# Altium schematic sheet [0X] - AUDIO.SchDoc
size 513 x 386 mm
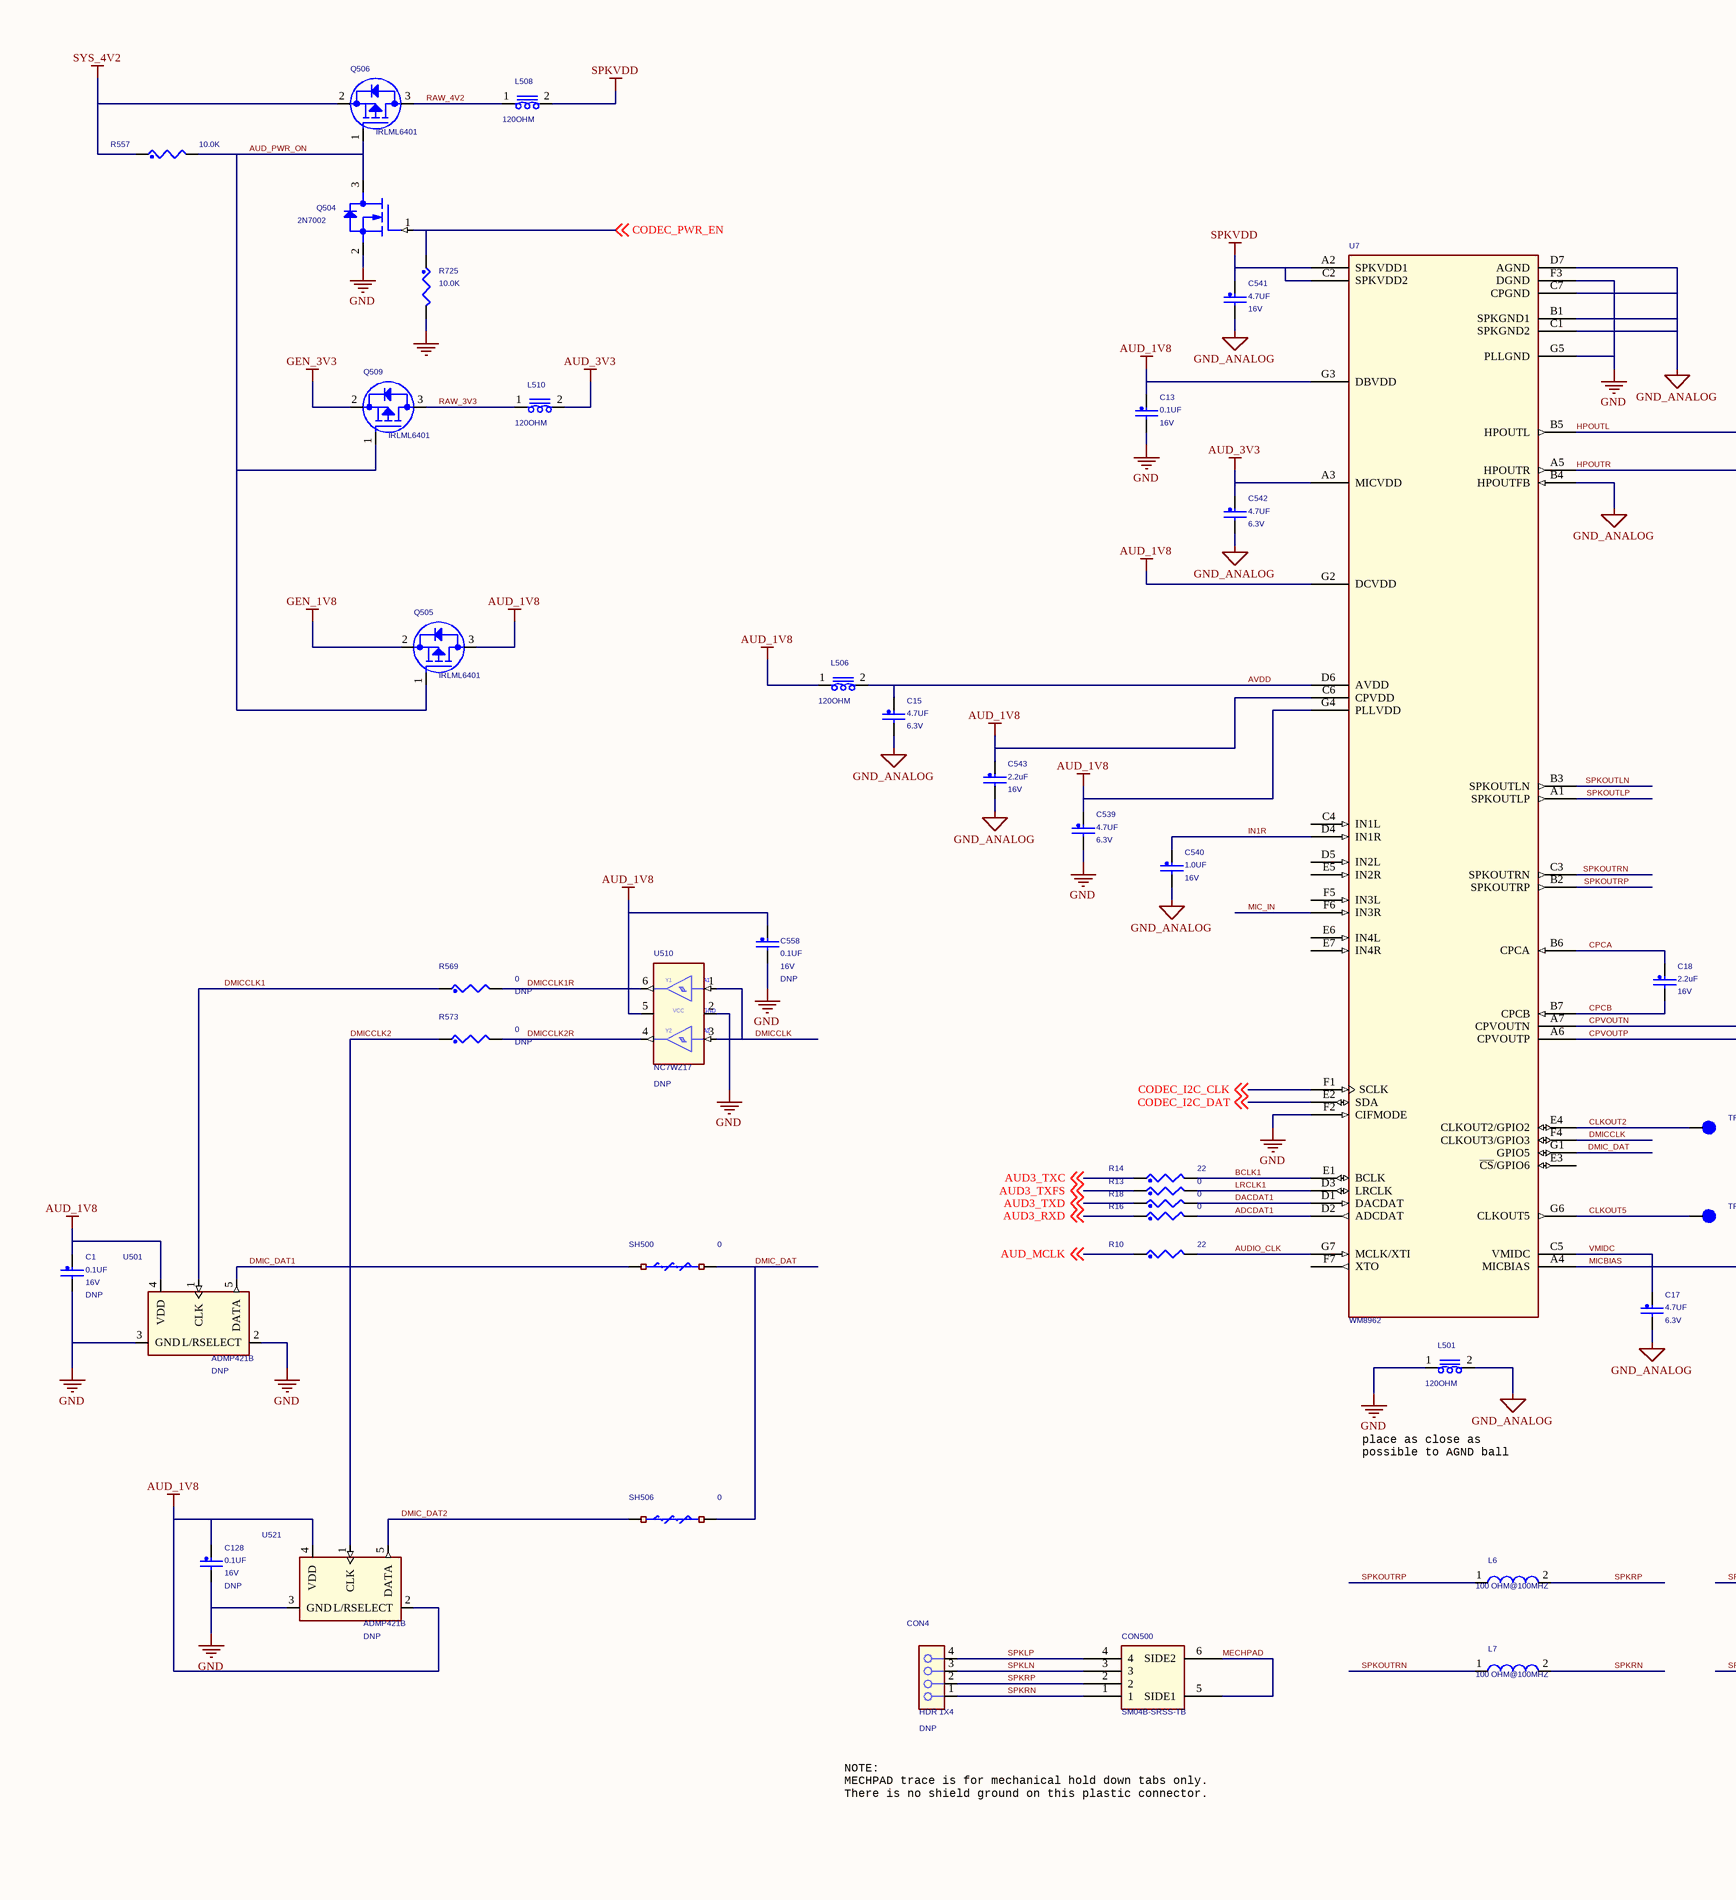
[diagram p0: [0X] - AUDIO.SchDoc, left]
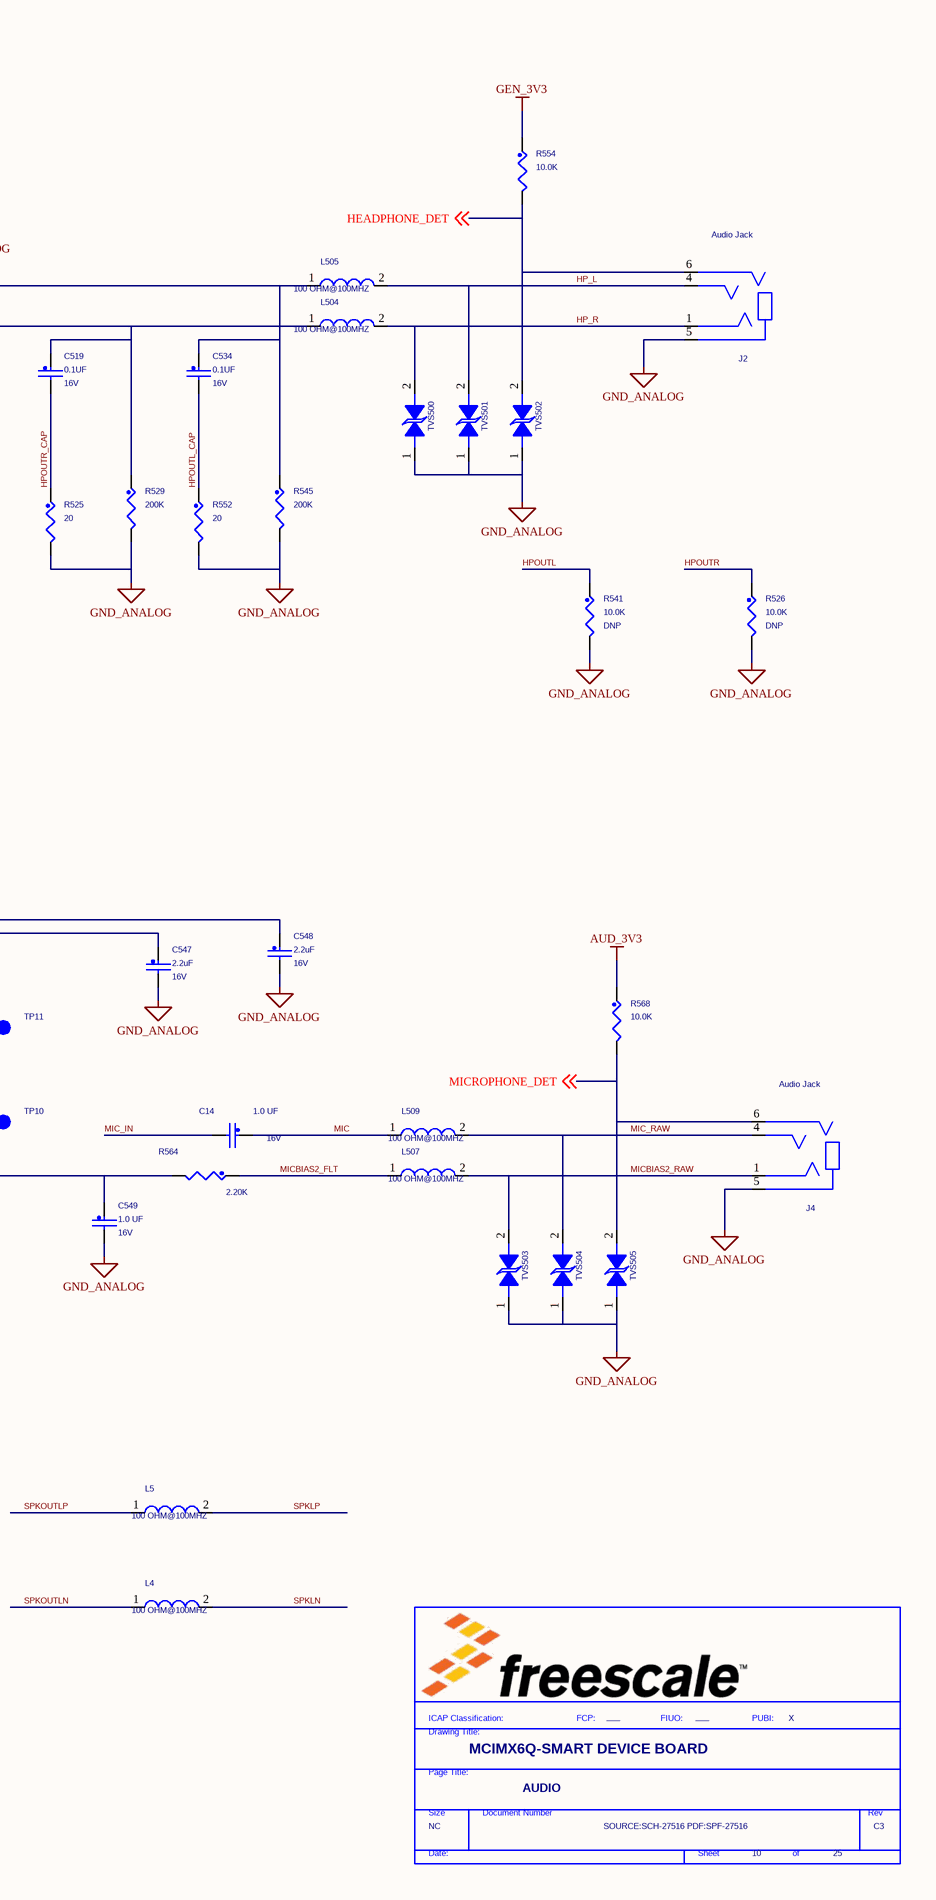
[diagram p1: [0X] - AUDIO.SchDoc, right]

## Parts
*  FIUO: ___  PUBI: X  Doc: SOURCE:SCH-27516 PDF:SPF-27516  RevCode: C3  Title: MCIMX6Q-SMART DEVICE BOARD  Page Size: NC  Page Number: 10  Page Count: 25  PageTitle: AUDIO  (hidden comment: TitleBlock_FS)  (graphical)
C1  0.1UF  ASSY_OPT: DNP  WVDC: 16V  [0402_CC]
C13  0.1UF  WVDC: 16V  [0402_CC]
C14  1.0 UF  WVDC: 16V  [0603_CC]
C15  4.7UF  WVDC: 6.3V  [0603_CC]
C17  4.7UF  WVDC: 6.3V  [0603_CC]
C18  2.2uF  WVDC: 16V  [0603_CC]
C128  0.1UF  ASSY_OPT: DNP  WVDC: 16V  [0402_CC]
C519  0.1UF  WVDC: 16V  [0402_CC]
C534  0.1UF  WVDC: 16V  [0402_CC]
C539  4.7UF  WVDC: 6.3V  [0603_CC]
C540  1.0UF  WVDC: 16V  [0402_CC]
C541  4.7UF  WVDC: 16V  [0603_CC]
C542  4.7UF  WVDC: 6.3V  [0603_CC]
C543  2.2uF  WVDC: 16V  [0603_CC]
C547  2.2uF  WVDC: 16V  [0603_CC]
C548  2.2uF  WVDC: 16V  [0603_CC]
C549  1.0 UF  WVDC: 16V  [0603_CC]
C558  0.1UF  ASSY_OPT: DNP  WVDC: 16V  [0402_CC]
CON4  HDR 1X4  ASSY_OPT: DNP  [HDR104]
CON500  SM04B-SRSS-TB  [con_4m_1mm_sm_ra]
J2  Audio Jack  [CON5_AUD_JACK_RA_TH_SJ-43514]
J4  Audio Jack  [CON5_AUD_JACK_RA_TH_SJ-43514]
L4  100 OHM@100MHZ  [0603_CC]
L5  100 OHM@100MHZ  [0603_CC]
L6  100 OHM@100MHZ  [0603_CC]
L7  100 OHM@100MHZ  [0603_CC]
L501  120OHM  [0603_CC]
L504  100 OHM@100MHZ  [0603_CC]
L505  100 OHM@100MHZ  [0603_CC]
L506  120OHM  [0603_CC]
L507  100 OHM@100MHZ  [0603_CC]
L508  120OHM  [0603_CC]
L509  100 OHM@100MHZ  [0603_CC]
L510  120OHM  [0603_CC]
Q504  2N7002  [SOT23]
Q505  IRLML6401  [sot-23]
Q506  IRLML6401  [sot-23]
Q509  IRLML6401  [sot-23]
R10  22  [0603_CC]
R13  0  [0402_CC]
R14  22  [0603_CC]
R16  0  [0402_CC]
R18  0  [0402_CC]
R525  20  [0603_CC]
R526  10.0K  ASSY_OPT: DNP  [0402_CC]
R529  200K  [0603_CC]
R541  10.0K  ASSY_OPT: DNP  [0402_CC]
R545  200K  [0603_CC]
R552  20  [0603_CC]
R554  10.0K  [0402_CC]
R557  10.0K  [0402_CC]
R564  2.20K  [0603_CC]
R568  10.0K  [0402_CC]
R569  0  ASSY_OPT: DNP  [0402_CC]
R573  0  ASSY_OPT: DNP  [0402_CC]
R725  10.0K  [0402_CC]
SH500  0  [SH0402_CC]
SH506  0  [SH0402_CC]
TP10  tpad_020  [tpad_020]  (value not drawn)
TP11  tpad_020  [tpad_020]  (value not drawn)
TVS500  ESD9B3.3ST5G  [SOD-923_NP]  (value not drawn)
TVS501  ESD9B3.3ST5G  [SOD-923_NP]  (value not drawn)
TVS502  ESD9B3.3ST5G  [SOD-923_NP]  (value not drawn)
TVS503  ESD9B3.3ST5G  [SOD-923_NP]  (value not drawn)
TVS504  ESD9B3.3ST5G  [SOD-923_NP]  (value not drawn)
TVS505  ESD9B3.3ST5G  [SOD-923_NP]  (value not drawn)
U7  WM8962  [bga49_0p5_3p62x4]
U501  ADMP421B  ASSY_OPT: DNP  [lga5_cav_4p1x3p1mm]
U510  NC7WZ17  ASSY_OPT: DNP  [SC-70-6]
U521  ADMP421B  ASSY_OPT: DNP  [lga5_cav_4p1x3p1mm]

## Nets
AUD_1V8: C1.1 C13.1 C128.1 C539.1 C543.1 C558.1 L506.1 Q505.3(DRAIN) U7.C6(CPVDD) U7.G2(DCVDD) U7.G3(DBVDD) U7.G4(PLLVDD) U501.4(VDD) U510.5(VCC) U521.2(L/RSELECT) U521.4(VDD)
AUD_3V3: C542.1 L510.2 R568.1 U7.A3(MICVDD)
GEN_1V8: Q505.2(SOURCE)
GEN_3V3: Q509.2(SOURCE) R554.1
GND: C1.2 C13.2 C128.2 C539.2 C558.2 L501.1 Q504.2(SOURCE) R725.2 U7.F2(CIFMODE) U7.F3(DGND) U7.G5(PLLGND) U501.2(L/RSELECT) U501.3(GND) U510.2(GND) U521.3(GND)
GND_ANALOG: C15.2 C17.2 C540.2 C541.2 C542.2 C543.2 C547.2 C548.2 C549.2 J2.5 J4.5 L501.2 R525.2 R526.2 R529.2 R541.2 R545.2 R552.2 TVS500.1(A1) TVS501.1(A1) TVS502.1(A1) TVS503.1(A1) TVS504.1(A1) TVS505.1(A1) U7.B1(SPKGND1) U7.B4(HPOUTFB) U7.C1(SPKGND2) U7.C7(CPGND) U7.D7(AGND)
SPKVDD: C541.1 L508.2 U7.A2(SPKVDD1) U7.C2(SPKVDD2)
SYS_4V2: Q506.2(SOURCE) R557.1
ADCDAT1: R16.2 U7.D2(ADCDAT)
AUD3_RXD: R16.1 ; off-sheet AUD3_RXD
AUD3_TXC: R14.1 ; off-sheet AUD3_TXC
AUD3_TXD: R18.1 ; off-sheet AUD3_TXD
AUD3_TXFS: R13.1 ; off-sheet AUD3_TXFS
AUD_MCLK: R10.1 ; off-sheet AUD_MCLK
AUD_PWR_ON: Q504.3(DRAIN) Q505.1(GATE) Q506.1(GATE) Q509.1(GATE) R557.2
AUDIO_CLK: R10.2 U7.G7(MCLK/XTI)
AVDD: C15.1 L506.2 U7.D6(AVDD)
BCLK1: R14.2 U7.E1(BCLK)
CLKOUT2: TP11.1(Pin1) U7.E4(CLKOUT2/GPIO2)
CLKOUT5: TP10.1(Pin1) U7.G6(CLKOUT5)
CODEC_I2C_CLK: U7.F1(SCLK) ; off-sheet CODEC_I2C_CLK
CODEC_I2C_DAT: U7.E2(SDA) ; off-sheet CODEC_I2C_DAT
CODEC_PWR_EN: Q504.1(GATE) R725.1 ; off-sheet CODEC_PWR_EN
CPCA: C18.1 U7.B6(CPCA)
CPCB: C18.2 U7.B7(CPCB)
CPVOUTN: C548.1 U7.A7(CPVOUTN)
CPVOUTP: C547.1 U7.A6(CPVOUTP)
DACDAT1: R18.2 U7.D1(DACDAT)
DMIC_DAT: SH500.2 SH506.2 U7.G1(GPIO5)
DMIC_DAT1: SH500.1 U501.5(DATA)
DMIC_DAT2: SH506.1 U521.5(DATA)
DMICCLK: U7.F4(CLKOUT3/GPIO3) U510.1(A1) U510.3(A2)
DMICCLK1: R569.1 U501.1(CLK)
DMICCLK1R: R569.2 U510.6(Y1)
DMICCLK2: R573.1 U521.1(CLK)
DMICCLK2R: R573.2 U510.4(Y2)
HEADPHONE_DET: J2.6 R554.2 TVS502.2(A2) ; off-sheet HEADPHONE_DET
HP_L: J2.4 L505.2 TVS501.2(A2)
HP_R: J2.1 L504.2 TVS500.2(A2)
HPOUTL: C534.1 L505.1 R541.1 R545.1 U7.B5(HPOUTL)
HPOUTL_CAP: C534.2 R552.1
HPOUTR: C519.1 L504.1 R526.1 R529.1 U7.A5(HPOUTR)
HPOUTR_CAP: C519.2 R525.1
IN1R: C540.1 U7.D4(IN1R)
LRCLK1: R13.2 U7.D3(LRCLK)
MECHPAD: CON500.5(SIDE1) CON500.6(SIDE2)
MIC: C14.1 L509.1
MIC_IN: C14.2 U7.F6(IN3R)
MIC_RAW: J4.4 L509.2 TVS504.2(A2)
MICBIAS: C549.1 R564.2 U7.A4(MICBIAS)
MICBIAS2_FLT: L507.1 R564.1
MICBIAS2_RAW: J4.1 L507.2 TVS503.2(A2)
MICROPHONE_DET: J4.6 R568.2 TVS505.2(A2) ; off-sheet MICROPHONE_DET
RAW_3V3: L510.1 Q509.3(DRAIN)
RAW_4V2: L508.1 Q506.3(DRAIN)
SPKLN: CON4.3 CON500.3 L4.2
SPKLP: CON4.4 CON500.4 L5.2
SPKOUTLN: L4.1 U7.B3(SPKOUTLN)
SPKOUTLP: L5.1 U7.A1(SPKOUTLP)
SPKOUTRN: L7.1 U7.C3(SPKOUTRN)
SPKOUTRP: L6.1 U7.B2(SPKOUTRP)
SPKRN: CON4.1 CON500.1 L7.2
SPKRP: CON4.2 CON500.2 L6.2
VMIDC: C17.1 U7.C5(VMIDC)

Not connected (* = marked no-connect by the designer): U7 C4(IN1L) D5(IN2L) E3(~{CS}/GPIO6) E5(IN2R) E6(IN4L) E7(IN4R) F5(IN3L) F7(XTO)

## Notes on the sheet
- place as close as
  possible to AGND ball
- NOTE:
  MECHPAD trace is for mechanical hold down tabs only.
  There is no shield ground on this plastic connector.
- (in symbol TitleBlock_FS) ICAP Classification:; FCP:; FIUO:; PUBI:; Drawing Title:; Page Title:; Size; Document Number; Rev; Date:; Sheet; of

## Library data of the parts
* = TitleBlock_FS: OrgAddr2: Austin, TX 78735-8598; OrgAddr1: 6501 William Cannon Drive West; OrgName: Freescale Semiconductor; FCP: ___; Page Create Date: March  8, 1995
C1 C534 = CAP_NP: CAP CER 0.1UF 16V 10% X7R 0402; CLASS: DISCRETE; SIGNAL_MODEL: DEFAULT_CAPACITOR_100000pF_2_1; FPLIST: CC0402_25,CC0402_HD,0402_CC; CAD_APPROVED: Yes; MFG_PN01: C0402C104K4RAC; MFG_NAME01: KEMET; AGILE_PN: 150-75182; HEIGHT: 0.635MM; ROHS: Yes; Tolerance: 10%; VOLTAGE: 16V
C13 C519 = CAP_NP: CAP CER 0.1UF 16V 10% X7R 0402; CLASS: DISCRETE; SIGNAL_MODEL: DEFAULT_CAPACITOR_100000pF_2_1; AGILE_PN: 150-75182; MFG_NAME01: KEMET; MFG_PN01: C0402C104K4RAC; CAD_APPROVED: Yes; FPLIST: CC0402_25,CC0402_HD,0402_CC; Tolerance: 10%; ROHS: Yes; HEIGHT: 0.635MM; VOLTAGE: 16V
C14 = CAP_NP: CAP CER 1.0UF 16V 10% X7R 0603; CLASS: DISCRETE; AGILE_PN: 150-30028; MFG_NAME01: AVX; MFG_PN01: 0603YC105KAT2A; CAD_APPROVED: Yes; FPLIST: CC0603_OV,CC0603,0603_CC; Tolerance: 10%; ROHS: Yes; HEIGHT: 1.0MM; VOLTAGE: 16V
C15 C542 = CAP_NP: CAP CER 4.7UF 6.3V 10% X5R 0603; CLASS: DISCRETE; SIGNAL_MODEL: DEFAULT_CAPACITOR_4.7e+06pF_2_1; AGILE_PN: 150-75487; MFG_NAME01: VENKEL COMPANY; MFG_PN01: C0603X5R6R3-475KNP; CAD_APPROVED: Yes; FPLIST: CC0603_OV,CC0603,0603_CC; Tolerance: 10%; ROHS: Yes; HEIGHT: 1.016MM; VOLTAGE: 6.3V
C17 C539 = CAP_NP: CAP CER 4.7UF 6.3V 10% X5R 0603; CLASS: DISCRETE; SIGNAL_MODEL: DEFAULT_CAPACITOR_4.7e+06pF_2_1; FPLIST: CC0603_OV,CC0603,0603_CC; CAD_APPROVED: Yes; MFG_PN01: C0603X5R6R3-475KNP; MFG_NAME01: VENKEL COMPANY; AGILE_PN: 150-75487; HEIGHT: 1.016MM; ROHS: Yes; Tolerance: 10%; VOLTAGE: 6.3V
C18 C543 C547 = CAP_NP: CAP CER 2.2UF 16V 10% X5R 0603; CLASS: DISCRETE; SIGNAL_MODEL: DEFAULT_CAPACITOR_2.2e+06pF_2_1; FPLIST: CC0603_OV,CC0603,0603_CC; CAD_APPROVED: YES; MFG_PN01: GRM188R61C225KE15D; MFG_NAME01: MURATA; AGILE_PN: 150-75417; HEIGHT: 0.9 MM; ROHS: Yes; Tolerance: 10%; VOLTAGE: 16V
C128 C558 = CAP_NP: CAP CER 0.1UF 16V 10% X7R 0402; CLASS: DISCRETE; FPLIST: CC0402_25,CC0402_HD,0402_CC; CAD_APPROVED: Yes; MFG_PN01: C0402C104K4RAC; MFG_NAME01: KEMET; AGILE_PN: 150-75182; SIGNAL_MODEL: DEFAULT_CAPACITOR_100000pF_2_1; VOLTAGE: 16V; HEIGHT: 0.635MM; ROHS: Yes; Tolerance: 10%
C540 = CAP_NP: CAP CER 1.0UF 10V 10% X5R 0402; CLASS: DISCRETE; SIGNAL_MODEL: DEFAULT_CAPACITOR_100000pF_2_1; FPLIST: CC0402_25,CC0402_HD,0402_CC; CAD_APPROVED: Yes; MFG_PN01: CC0402KRX5R6BB105; MFG_NAME01: YAGEO AMERICA; AGILE_PN: 150-75772; HEIGHT: 0.6MM; ROHS: Yes
C541 = CAP_NP: CAP CER 4.7UF 10V 10% X5R 0603; CLASS: DISCRETE; SIGNAL_MODEL: DEFAULT_CAPACITOR_4.7e+06pF_2_1; AGILE_PN: 150-77975; MFG_NAME01: TAIYO YUDEN; MFG_PN01: LMK107BJ475KA-T; CAD_APPROVED: Yes; FPLIST: CC0603_OV,CC0603,0603_CC; Tolerance: 10%; ROHS: Yes; HEIGHT: 0.9MM; VOLTAGE: 10V
C548 = CAP_NP: CAP CER 2.2UF 16V 10% X5R 0603; CLASS: DISCRETE; SIGNAL_MODEL: DEFAULT_CAPACITOR_2.2e+06pF_2_1; AGILE_PN: 150-75417; MFG_NAME01: MURATA; MFG_PN01: GRM188R61C225KE15D; CAD_APPROVED: YES; FPLIST: CC0603_OV,CC0603,0603_CC; Tolerance: 10%; ROHS: Yes; HEIGHT: 0.9 MM; VOLTAGE: 16V
C549 = CAP_NP: CAP CER 1.0UF 16V 10% X7R 0603; CLASS: DISCRETE; SIGNAL_MODEL: DEFAULT_CAPACITOR_1e+06pF_2_1; FPLIST: CC0603_OV,CC0603,0603_CC; CAD_APPROVED: Yes; MFG_PN01: 0603YC105KAT2A; MFG_NAME01: AVX; AGILE_PN: 150-30028; HEIGHT: 1.0MM; ROHS: Yes; Tolerance: 10%; VOLTAGE: 16V
CON4 = CONN_HDR_4X1: HDR 1X4 TH 100MIL SP 395H SN 110L; CLASS: IO; CAD_APPROVED: Yes; MFG_PN01: 3-644456-4; MFG_NAME01: TYCO ELECTRONICS; AGILE_PN: 210-78427; HEIGHT: 10.29MM; ROHS: Yes
CON500 = SM04B: CON 1x4 PLUG SHDR SMT 1MM SP 116H SN; CLASS: IO; CAD_APPROVED: Yes; MFG_PN01: SM04B-SRSS-TB(LF)(SN); MFG_NAME01: JST MFG. CO; AGILE_PN: 211-78726; HEIGHT: 2.95MM; ROHS: Yes
J2 J4 = 3.5MM_AUDIO_JACK: CON 1 AUD JACK 3.5MM RA TH 205H SN 86L; CLASS: IO; CAD_APPROVED: Yes; MFG_PN01: SJ-43514; MFG_NAME01: CUI INC; AGILE_PN: 210-79826; HEIGHT: 5.2MM; ROHS: Yes
L4 L504 L507 L509 = IND: IND FER BEAD 100 OHM@100MHZ 1A 25% 0603; PART_TYPE: Inductor; CLASS: DISCRETE; FPLIST: IND_0603,0603_CC; CAD_APPROVED: Yes; MFG_PN01: MPZ1608D101B; MFG_NAME01: TDK; AGILE_PN: 180-75495; HEIGHT: 0.95MM; ROHS: Yes; Tolerance: 25%
L5 L6 = IND: IND FER BEAD 100 OHM@100MHZ 1A 25% 0603; PART_TYPE: Inductor; CLASS: DISCRETE; SIGNAL_MODEL: DEFAULT_INDUCTOR_22000nH_2_1; FPLIST: IND_0603,0603_CC; CAD_APPROVED: Yes; MFG_PN01: MPZ1608D101B; MFG_NAME01: TDK; AGILE_PN: 180-75495; HEIGHT: 0.95MM; ROHS: Yes; Tolerance: 25%
L7 L505 = IND: IND FER BEAD 100 OHM@100MHZ 1A 25% 0603; PART_TYPE: Inductor; CLASS: DISCRETE; AGILE_PN: 180-75495; MFG_NAME01: TDK; MFG_PN01: MPZ1608D101B; CAD_APPROVED: Yes; FPLIST: IND_0603,0603_CC; Tolerance: 25%; ROHS: Yes; HEIGHT: 0.95MM
L501 L510 = BEAD_0: IND FER BEAD 120OHM@100MHZ 2A 25% 0603; PART_TYPE: FERRITE; CLASS: DISCRETE; PRIORITY_PN: 024-00067; MFG_NAME01: MURATA; CAD_APPROVED: Yes; FPLIST: IND_0603,0603_CC; AGILE_PN: 180-30008; MFG_PN01: BLM18PG121SH1; ROOM: RGMII_PHY; Tolerance: 25%; HEIGHT: 0.95MM; ROHS: Yes
L506 L508 = BEAD_0: IND FER BEAD 120OHM@100MHZ 2A 25% 0603; PART_TYPE: FERRITE; CLASS: DISCRETE; ROOM: RGMII_PHY; MFG_PN01: BLM18PG121SH1; AGILE_PN: 180-30008; FPLIST: IND_0603,0603_CC; CAD_APPROVED: Yes; MFG_NAME01: MURATA; PRIORITY_PN: 024-00067; ROHS: Yes; HEIGHT: 0.95MM; Tolerance: 25%
Q504 = 2N7002: TRAN NMOS 60V 115MA SOT23; CLASS: IC; CAD_APPROVED: Yes; MFG_PN01: 2N7002LT1G; MFG_NAME01: ON SEMICONDUCTOR; AGILE_PN: 480-75159; HEIGHT: 1.3MM; ROHS: Yes
Q505 Q506 = MOSFET_P: TRAN PMOS PWR 12V 4.3A SOT23; CLASS: IC; CAD_APPROVED: Yes; MFG_PN01: IRLML6401TRPBF; MFG_NAME01: INTERNATIONAL RECTIFIER; AGILE_PN: 480-77718; HEIGHT: 1.12MM; ROHS: Yes
Q509 = MOSFET_P: TRAN PMOS PWR 12V 4.3A SOT23; CLASS: IC; AGILE_PN: 480-77718; MFG_NAME01: INTERNATIONAL RECTIFIER; MFG_PN01: IRLML6401TRPBF; CAD_APPROVED: Yes; ROHS: Yes; HEIGHT: 1.12MM
R10 R14 = RES: RES MF 22.0 OHM 1/10W 1% 0603; CLASS: DISCRETE; SIGNAL_MODEL: DEFAULT_RESISTOR_22OHM_2_1; FPLIST: RC0603_OV,RC0603,0603_CC; CAD_APPROVED: Yes; MFG_PN01: RK73H1JTTD22R0F; MFG_NAME01: KOA SPEER; AGILE_PN: 470-75425; ROHS: Yes; Tolerance: 1%
R13 R16 R18 R569 R573 = RES: RES MF ZERO OHM 1/10W -- 0402; CLASS: DISCRETE; SIGNAL_MODEL: DEFAULT_RESISTOR_0.001OHM_2_1; FPLIST: RC0402_25,RC0402_HD,RC0402_X2,0402_CC; CAD_APPROVED: Yes; MFG_PN01: ERJ-2GE0R00X; MFG_NAME01: Panasonic; AGILE_PN: 470-79965; ROHS: Yes
R525 R552 = RES: RES MF 20.0OHM 1/10W 1% 0603; CLASS: DISCRETE; SIGNAL_MODEL: DEFAULT_RESISTOR_20OHM_2_1; FPLIST: RC0603_OV,RC0603,0603_CC; CAD_APPROVED: Yes; MFG_PN01: RK73H1JTTD20R0F; MFG_NAME01: KOA SPEER; AGILE_PN: 470-75405; ROHS: Yes; Tolerance: 1%
R526 R541 R568 = RES: RES MF 10.0K 1/16W 1% 0402; CLASS: DISCRETE; SIGNAL_MODEL: DEFAULT_RESISTOR_10000OHM_2_1; AGILE_PN: 470-75416; MFG_NAME01: VISHAY INTERTECHNOLOGY; MFG_PN01: CRCW040210K0FKED; CAD_APPROVED: Yes; FPLIST: RC0402_25,RC0402_HD,0402_CC; Tolerance: 1%; ROHS: Yes
R529 R545 = RES: RES MF 200K 1/10W 1% 0603; CLASS: DISCRETE; SIGNAL_MODEL: DEFAULT_RESISTOR_200000OHM_2_1; AGILE_PN: 470-76381; MFG_NAME01: KOA SPEER; MFG_PN01: RK73H1JTTD2003F; CAD_APPROVED: Yes; FPLIST: RC0603_OV,RC0603,0603_CC; Tolerance: 1%; ROHS: Yes
R554 R557 = RES: RES MF 10.0K 1/16W 1% 0402; CLASS: DISCRETE; SIGNAL_MODEL: DEFAULT_RESISTOR_10000OHM_2_1; FPLIST: RC0402_25,RC0402_HD,0402_CC; CAD_APPROVED: Yes; MFG_PN01: CRCW040210K0FKED; MFG_NAME01: VISHAY INTERTECHNOLOGY; AGILE_PN: 470-75416; ROHS: Yes; Tolerance: 1%
R564 = RES: RES MF 2.20K 1/10W 1% 0603; CLASS: DISCRETE; SIGNAL_MODEL: DEFAULT_RESISTOR_2200OHM_2_1; FPLIST: RC0603_OV,RC0603,0603_CC; CAD_APPROVED: Yes; MFG_PN01: RK73H1JTTD2201F; MFG_NAME01: KOA SPEER; AGILE_PN: 470-75806; ROHS: Yes; Tolerance: 1%
R725 = RES: RES MF 10.0K 1/16W 1% 0402; CLASS: DISCRETE; AGILE_PN: 470-75416; MFG_NAME01: VISHAY INTERTECHNOLOGY; MFG_PN01: CRCW040210K0FKED; CAD_APPROVED: Yes; FPLIST: RC0402_25,RC0402_HD,0402_CC; SIGNAL_MODEL: DEFAULT_RESISTOR_10000OHM_2_1; Tolerance: 1%; ROHS: Yes
SH500 SH506 = RES_SHORT-2: ZERO OHM CUT TRACE 0402 PADS; NO PART TO ORDER; CLASS: DISCRETE; SIGNAL_MODEL: DEFAULT_RESISTOR_0.001OHM_2_1; FPLIST: SH0402,SH0402_CC; CAD_APPROVED: Yes; ASSY_OPT: DNP; MFG_PN01: LAYOUT ELEMENT ONLY; AGILE_PN: 470-76449; ROHS: Yes; MFG_NAME01: LAYOUT ELEMENT ONLY
TP10 TP11 = TESTLOOP: TEST POINT PAD 0.5MM DIA SMT, NO PART TO ORDER; CLASS: IO; AGILE_PN: 211-77484; ASSY_OPT: DNP; CAD_APPROVED: Yes; ROHS: Yes; HEIGHT: 0.1MM
TVS500 TVS501 TVS504 = DIODE_TVS_BIDIR: DIODE TVS LOW CAP 3.3V SOD-923; CLASS: IC; AGILE_PN: 480-77957; MFG_NAME01: On Semiconductor; CAD_APPROVED: Yes; MFG_PN01: ESD9B3.3ST5G; ROHS: Yes; HEIGHT: 0.4MM
TVS502 TVS503 TVS505 = DIODE_TVS_BIDIR: DIODE TVS LOW CAP 3.3V SOD-923; CLASS: IC; CAD_APPROVED: Yes; MFG_NAME01: On Semiconductor; AGILE_PN: 480-77957; HEIGHT: 0.4MM; ROHS: Yes; MFG_PN01: ESD9B3.3ST5G
U7 = WM8962_BGA_49P_CUST: IC AUDIO CODEC 24BIT DAC 2 CH ADC 1.8V BGA49; FPLIST: bga49_0p5_3p62x4,bga49_0p5_3p62x4_smdp; CAD_APPROVED: Yes; MFG_PN01: WM8962ECSN/R; MFG_NAME01: WOLFSON MICROELECTRONICS; AGILE_PN: 315-79434; CLASS: IC; HEIGHT: 0.75MM; ROHS: Yes
U501 U521 = ADMP421_LGA5: IC MIC WITH DIGITAL OUTPUT 1.8-3.3V LGA5; CAD_APPROVED: Yes; MFG_PN01: ADMP421BCEZ-RL7; MFG_NAME01: ANALOG DEVICES; AGILE_PN: 312-80554; CLASS: IC; HEIGHT: 1.1MM; ROHS: Yes
U510 = NC7WZ17: IC BUF DUAL SCHMITT 1.65-5.5V SC70-6; CAD_APPROVED: Yes; MFG_PN01: NC7WZ17P6X; MFG_NAME01: FAIRCHILD; AGILE_PN: 312-79527; CLASS: IC; HEIGHT: 1.1MM; ROHS: Yes